# EAGLE design untitled (EAGLE 9.6.2)
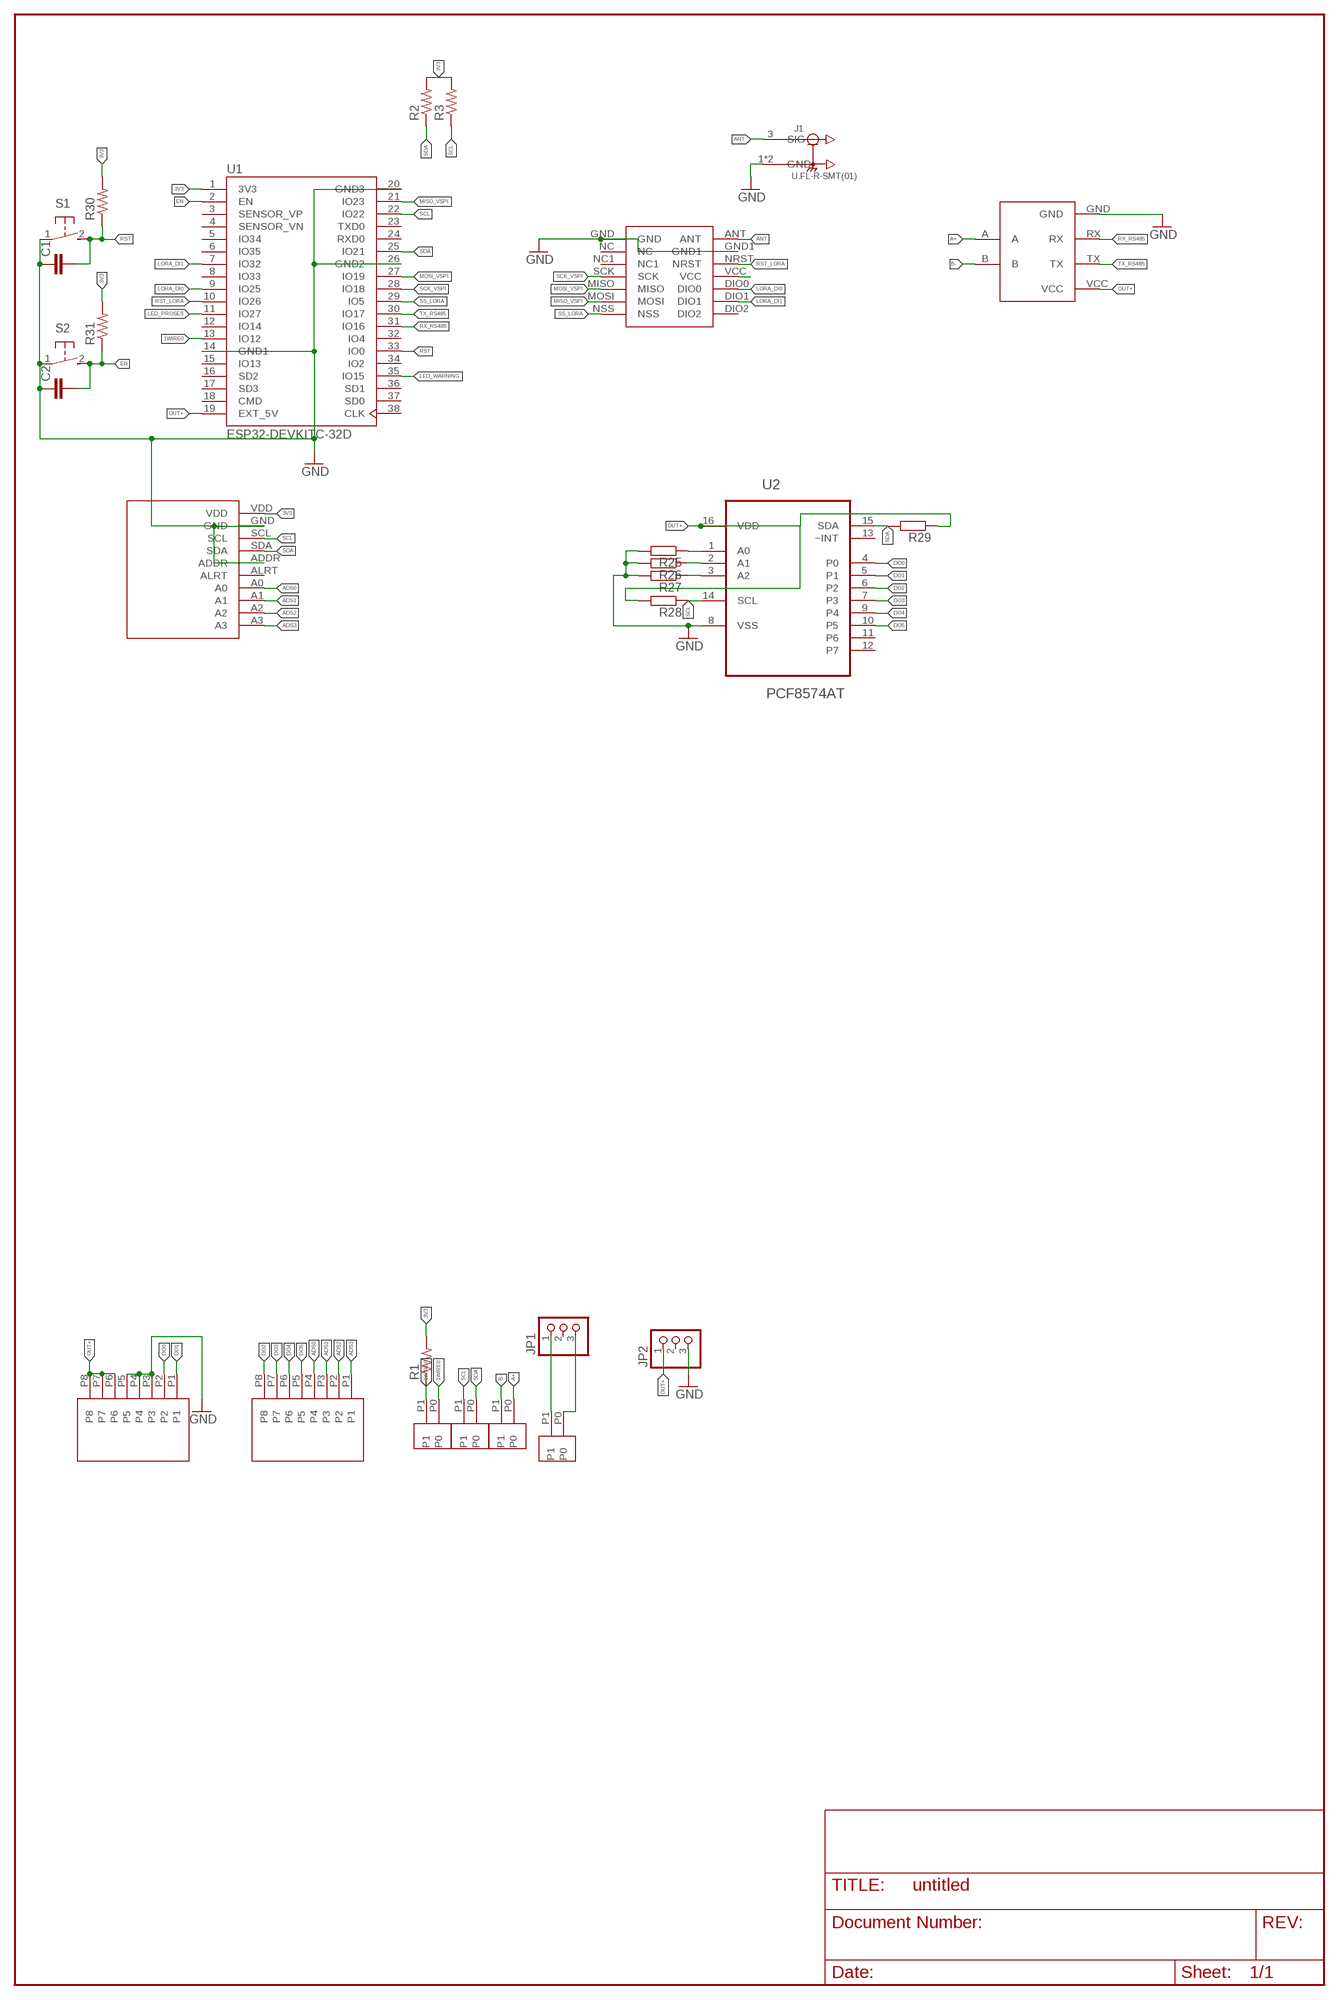
[diagram p0: schematic, sheet 1]

## Parts
ADS1  ADS1115  [ADS1115]
C1  C-EUC0805K  [C0805K]
C2  C-EUC0805K  [C0805K]
CONN2P-3.5PI1  CONN2P-3.5PI  [CONN2P-3.5PI]
CONN2P-3.5PI2  CONN2P-3.5PI  [CONN2P-3.5PI]
CONN2P-3.5PI3  CONN2P-3.5PI  [CONN2P-3.5PI]
CONN2P-3.5PI5  CONN2P-3.5PI  [CONN2P-3.5PI]
CONN3.1  CONN3.5  [CONN3.5]
CONN3.2  CONN3.5  [CONN3.5]
J1  U.FL-R-SMT(01)  [HRS_U.FL-R-SMT(01)]
JP1  PINHD-1X3  [1X03]
JP2  PINHD-1X3  [1X03]
LORA-NICERF-V1  LORA-NICERF-V2  [LORA-NICERF-V2]
R1  R-US_M0805  [M0805]
R2  R-US_M0805  [M0805]
R3  R-US_M0805  [M0805]
R25  R-EU_R0805  [R0805]
R26  R-EU_R0805  [R0805]
R27  R-EU_R0805  [R0805]
R28  R-EU_R0805  [R0805]
R29  R-EU_R0805  [R0805]
R30  R-US_M0805  [M0805]
R31  R-US_M0805  [M0805]
S1  31-XX  [B3F-31XX]
S2  31-XX  [B3F-31XX]
TTL-RS1  TTL-RS485  [TTL-RS485]
U1  ESP32-DEVKITC-32D  [MODULE_ESP32-DEVKITC-32D]
U2  PCF8574AT  [SOIC127P1032X265-16N]

## Nets
1WIRE0: CONN2P-3.5PI3.P0 CONN2P-3.5PI3.P1 R1.1 U1.13(IO12)
3V3: ADS1.VDD R1.2 R2.2 R3.2 R30.2 R31.2 U1.1(3V3)
A+: CONN2P-3.5PI5.P0 TTL-RS1.A
ADS0: ADS1.A0 CONN3.2.P4
ADS1: ADS1.A1 CONN3.2.P3
ADS2: ADS1.A2 CONN3.2.P2
ADS3: ADS1.A3 CONN3.2.P1
ANT: J1.3(SIG) LORA-NICERF-V1.ANT
B-: CONN2P-3.5PI5.P1 TTL-RS1.B
DO0: CONN3.1.P2 U2.4(P0)
DO1: CONN3.1.P1 U2.5(P1)
DO2: CONN3.2.P8 U2.6(P2)
DO3: CONN3.2.P7 U2.7(P3)
DO4: CONN3.2.P6 U2.9(P4)
DO5: CONN3.2.P5 U2.10(P5)
EN: C2.2 R31.1 S2.2(S) U1.2(EN)
GND: ADS1.ADDR ADS1.GND C1.1 C2.1 CONN3.1.P3 CONN3.1.P4 CONN3.1.P5 J1.1(GND) J1.2(GND) JP2.3 LORA-NICERF-V1.GND LORA-NICERF-V1.GND1 R25.2 R26.2 R27.2 S1.1(P) S2.1(P) TTL-RS1.GND U1.14(GND1) U1.20(GND3) U1.26(GND2) U2.8(VSS)
LED_PROSES: U1.11(IO27)
LED_WARNING: U1.35(IO15)
LORA_DI0: LORA-NICERF-V1.DIO0 U1.9(IO25)
LORA_DI1: LORA-NICERF-V1.DIO1 U1.7(IO32)
MISO_VSPI: LORA-NICERF-V1.MOSI U1.21(IO23)
MOSI_VSPI: LORA-NICERF-V1.MISO U1.27(IO19)
N$1: R25.1 U2.1(A0)
N$2: R26.1 U2.2(A1)
N$3: R27.1 U2.3(A2)
N$4: CONN2P-3.5PI1.P1 JP1.1
N$5: CONN2P-3.5PI1.P0 JP1.3
N$26: LORA-NICERF-V1.VCC
OUT+: CONN3.1.P6 CONN3.1.P7 CONN3.1.P8 JP2.1 R28.2 R29.1 TTL-RS1.VCC U1.19(EXT_5V) U2.16(VDD)
RST: C1.2 R30.1 S1.2(S) U1.33(IO0)
RST_LORA: LORA-NICERF-V1.NRST U1.10(IO26)
RX_RS485: TTL-RS1.RX U1.31(IO16)
SCK_VSPI: LORA-NICERF-V1.SCK U1.28(IO18)
SCL: ADS1.SCL CONN2P-3.5PI2.P1 R3.1 R28.1 U1.22(IO22) U2.14(SCL)
SDA: ADS1.SDA CONN2P-3.5PI2.P0 R2.1 R29.2 U1.25(IO21) U2.15(SDA)
SS_LORA: LORA-NICERF-V1.NSS U1.29(IO5)
TX_RS485: TTL-RS1.TX U1.30(IO17)
Unconnected: ADS1.ALRT JP1.2 JP2.2 LORA-NICERF-V1.DIO2 LORA-NICERF-V1.NC LORA-NICERF-V1.NC1 U1.3(SENSOR_VP) U1.4(SENSOR_VN) U1.5(IO34) U1.6(IO35) U1.8(IO33) U1.12(IO14) U1.15(IO13) U1.16(SD2) U1.17(SD3) U1.18(CMD) U1.23(TXD0) U1.24(RXD0) U1.32(IO4) U1.34(IO2) U1.36(SD1) U1.37(SD0) U1.38(CLK) U2.11(P6) U2.12(P7) U2.13(~INT)

## Library data of the parts
ADS1 = ds1115:ADS1115
C1 C2 = rcl:C-EU: CAPACITOR, European symbol; SPICEPREFIX: C
CONN2P-3.5PI1-CONN2P-3.5PI3 CONN2P-3.5PI5 = CONN2P-3.5PI:CONN2P-3.5PI
CONN3.1 CONN3.2 = CONN3.5:CONN3.5
J1 = U.FL-R-SMT_01_:U.FL-R-SMT(01): U.FL Series 6 Ghz 50 Ohm Ultra-small SMT Coaxial Cable Receptacle Check availability <https://pricing.snapeda.com/parts/U.FL-R-SMT%2801%29/Hirose/view-part?ref=eda>; AVAILABILITY: In Stock; DESCRIPTION: U.FL (UMCC) Connector Receptacle, Male Pin 50Ohm Surface Mount Solder. RF Connectors / Coaxial Connectors; MF: Hirose; MP: U.FL-R-SMT(01); PACKAGE: None; PRICE: None; PURCHASE-URL: https://pricing.snapeda.com/search/part/U.FL-R-SMT(01)/?ref=eda
JP1 JP2 = pinhead:PINHD-1X3: PIN HEADER
LORA-NICERF-V1 = LORA-NICERF-V2:LORA-NICERF-V2
R1-R3 R30 R31 = adafruit:R-US_: RESISTOR, American symbol
R25-R29 = rcl:R-EU_: RESISTOR, European symbol; SPICEPREFIX: R
S1 S2 = switch-omron:31-XX: OMRON SWITCH; MPN: B3F-3100; OC_FARNELL: 959704; OC_NEWARK: 36M3582
TTL-RS1 = TTL-RS485:TTL-RS485
U1 = ESP32-DEVKITC-32D:ESP32-DEVKITC-32D: Eval Board For Esp-Wroom-32 Check availability <https://pricing.snapeda.com/parts/ESP32-DEVKITC-32D/Espressif%20Systems/view-part?ref=eda>; AVAILABILITY: In Stock; DESCRIPTION: WiFi Development Tools (802.11) ESP32 General Development Kit, ESP32-WROOM-32D on the board; MF: Espressif Systems; MP: ESP32-DEVKITC-32D; PACKAGE: None; PRICE: None; PURCHASE-URL: https://pricing.snapeda.com/search/part/ESP32-DEVKITC-32D/?ref=eda
U2 = PCF8574AT:PCF8574AT: Remote 8-bit I/O expander for I2C-bus Check availability <https://pricing.snapeda.com/parts/PCF8574AT/NXP%20USA/view-part?ref=eda>; AVAILABILITY: In Stock; DESCRIPTION: I²C Bus IC Operating temperature: -40...+85 °C Power supply: 2.5...6 V Package: SO-16W; MF: NXP USA; MP: PCF8574AT; PACKAGE: SOIC-16 NXP USA; PRICE: None; PURCHASE-URL: https://pricing.snapeda.com/search/part/PCF8574AT/?ref=eda

## Board
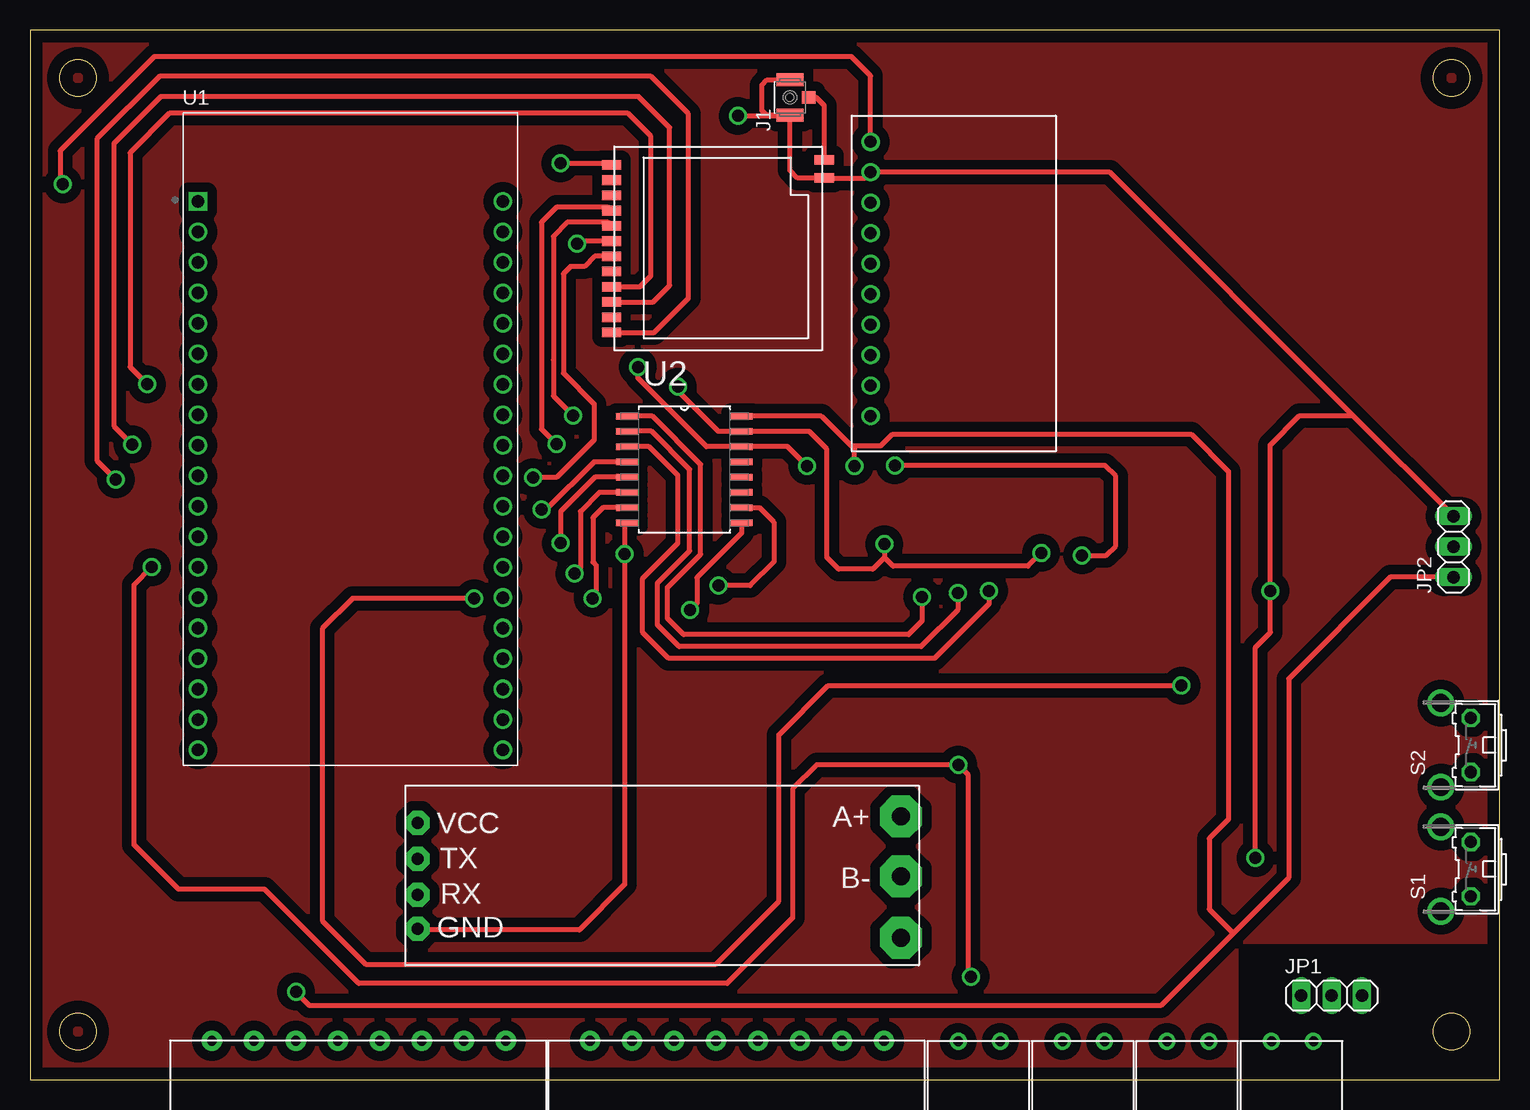
[diagram p1: board, top side]
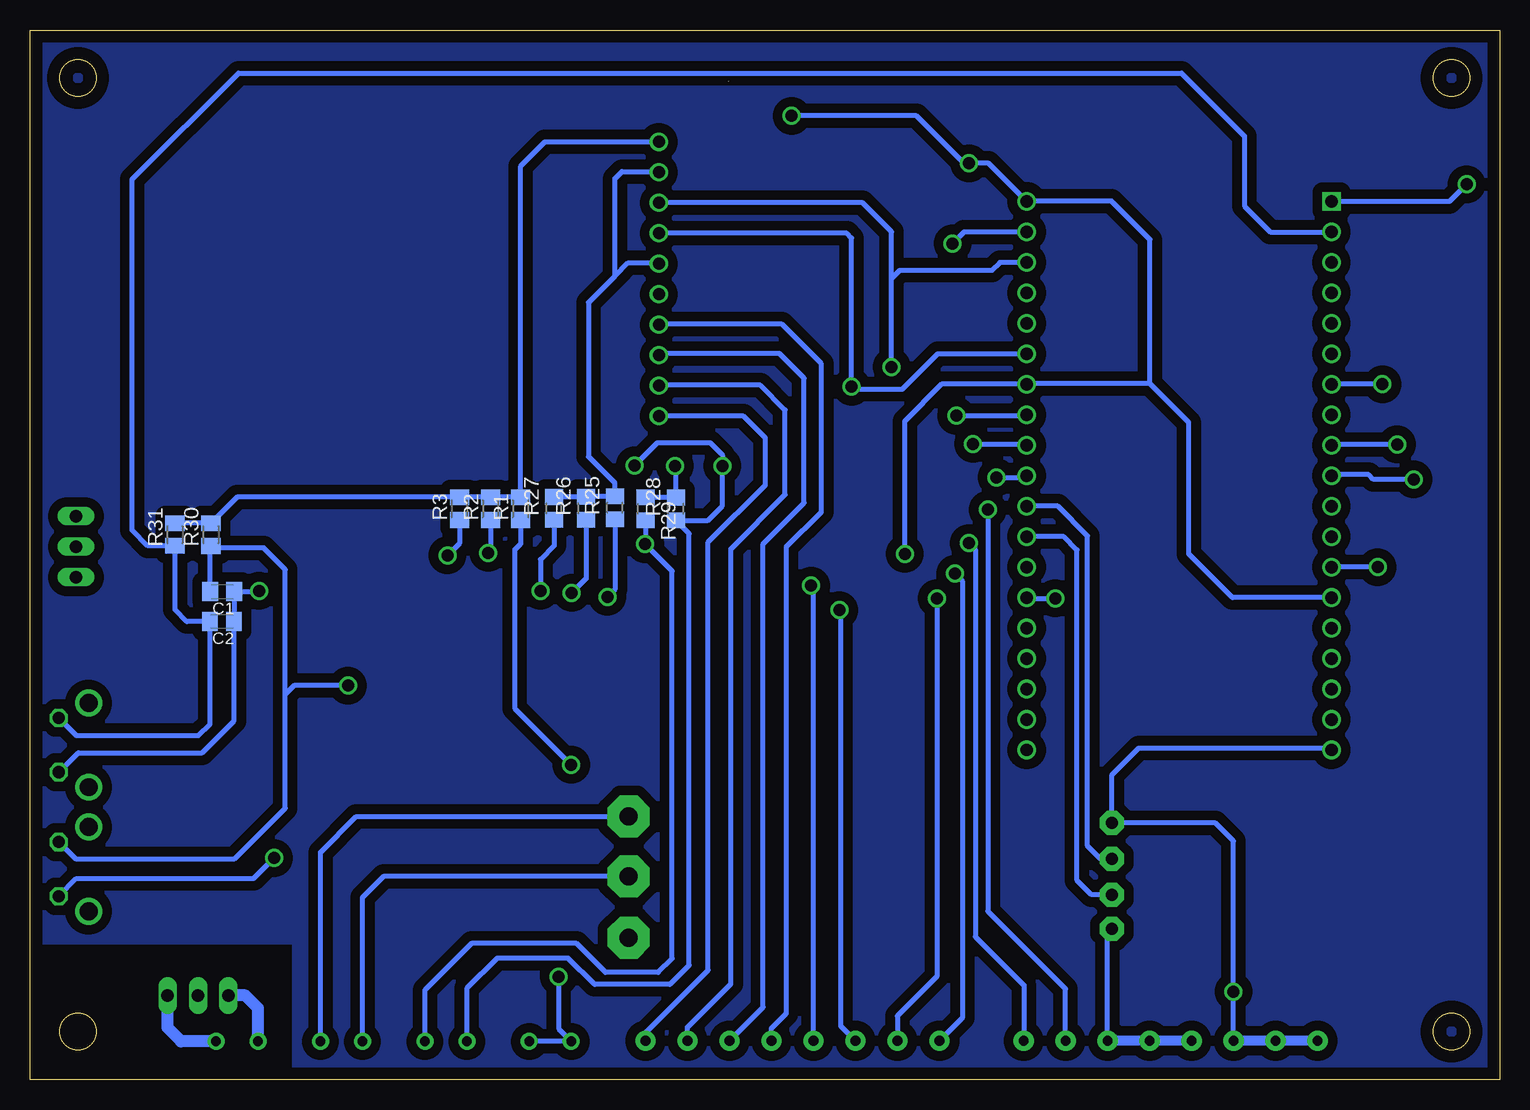
[diagram p2: board, bottom side, seen from below]

Size 122.5 x 87.5 mm. Coordinates in mm from the lower left corner, seen from the top.
Outline: 0,0 122.5,0 122.5,87.5 0,87.5 0,0
Outline: circle at 118.5,83.5 radius 1.5
Outline: circle at 118.5,4 radius 1.5
Outline: circle at 4,4 radius 1.5
Outline: circle at 4,83.5 radius 1.5
Copper layers (1*16): Top 0.035mm / dielectric 1.5mm / Bottom 0.035mm
Design rules "default": minimum track width 6mil, minimum drill 0.35mm, track to track 6mil, track to pad 6mil, pad to pad 6mil, via to via 6mil, smd to smd 6mil, copper to edge 40mil, drill to drill 6mil, minimum pad ring 10mil, minimum via ring 8mil, stop-mask expansion 4mil, vias tented up to drill 0mil, thermal gap 10mil

### Footprints (pad centres in the part's own frame; a part is rotated, then mirrored left to right if it is on the bottom)
ADS1115 = drill 1: A0 -6.35,-1.27; A1 -6.35,-3.81; A2 -6.35,-6.35; A3 -6.35,-8.89; ADDR -6.35,3.81; ALRT -6.35,1.27; GND -6.35,11.43; SCL -6.35,8.89; SDA -6.35,6.35; VDD -6.35,13.97
C0805K = smd 1.3 x 1.6: 1 -1,0; 2 1,0
CONN2P-3.5PI = drill 0.8 pad 1.422: P0 2.421,0.016; P1 5.921,0.016
CONN3.5 = drill 0.8 pad 1.676: P1 -28,0; P2 -24.5,0; P3 -21,0; P4 -17.5,0; P5 -14,0; P6 -10.5,0; P7 -7,0; P8 -3.5,0
HRS_U.FL-R-SMT(01) = smd 1.1 x 2.25: 1 -1.475,0; 2 1.475,0 | smd 1.05 x 1.1: 3 0,-1.55
1X03 = drill 1.016 long: 1 -2.54,0; 2 0,0; 3 2.54,0
LORA-NICERF-V2 = smd 1.6 x 0.8: ANT 9.17,6.81; DIO0 -8.57,-5.03; DIO1 -8.57,-3.76; DIO2 -8.57,-2.49; GND -8.57,6.4; GND1 9.17,5.31; MISO -8.57,1.32; MOSI -8.57,0.05; NC -8.57,5.13; NC1 -8.57,3.86; NRST -8.57,-7.57; NSS -8.57,-1.22; SCK -8.57,2.59; VCC -8.57,-6.3
M0805 = smd 1.3 x 1.6: 1 -0.95,0; 2 0.95,0
R0805 = smd 1.3 x 1.5: 1 -0.95,0; 2 0.95,0
B3F-31XX = drill 1.016 octagon: 1 -2.261,-1.245; 2 2.261,-1.245 | drill 1.499 pad 2.159: 3 -3.505,1.245; 4 3.505,1.245
TTL-RS485 = drill 1.5 pad 3.5 octagon: A -19.7,-6; B -19.7,-1; P$7 -19.7,4.1 | drill 1 pad 2 octagon: GND 20.6,3.37; RX 20.581,0.505; TX 20.583,-2.493; VCC 20.6,-5.47
MODULE_ESP32-DEVKITC-32D = drill 1.04 square: 1 -12.7,19.76 | drill 1.04: 2 -12.7,17.22; 3 -12.7,14.68; 4 -12.7,12.14; 5 -12.7,9.6; 6 -12.7,7.06; 7 -12.7,4.52; 8 -12.7,1.98; 9 -12.7,-0.56; 10 -12.7,-3.1; 11 -12.7,-5.64; 12 -12.7,-8.18; 13 -12.7,-10.72; 14 -12.7,-13.26; 15 -12.7,-15.8; 16 -12.7,-18.34; 17 -12.7,-20.88; 18 -12.7,-23.42; 19 -12.7,-25.96; 20 12.7,19.76; 21 12.7,17.22; 22 12.7,14.68; 23 12.7,12.14; 24 12.7,9.6; 25 12.7,7.06; 26 12.7,4.52; 27 12.7,1.98; 28 12.7,-0.56; 29 12.7,-3.1; 30 12.7,-5.64; 31 12.7,-8.18; 32 12.7,-10.72; 33 12.7,-13.26; 34 12.7,-15.8; 35 12.7,-18.34; 36 12.7,-20.88; 37 12.7,-23.42; 38 12.7,-25.96
SOIC127P1032X265-16N = smd 1.803 x 0.533: 1 -4.775,4.445; 2 -4.775,3.175; 3 -4.775,1.905; 4 -4.775,0.635; 5 -4.775,-0.635; 6 -4.775,-1.905; 7 -4.775,-3.175; 8 -4.775,-4.445; 9 4.775,-4.445; 10 4.775,-3.175; 11 4.775,-1.905; 12 4.775,-0.635; 13 4.775,0.635; 14 4.775,1.905; 15 4.775,3.175; 16 4.775,4.445

### Placement (x,y rotation side)
ADS1  76.43,64.2 0 top
C1  106.48,40.68 180 bottom
C2  106.5,38.19 180 bottom
CONN2P-3.5PI1  109.41,3.2 180 top
CONN2P-3.5PI2  92,3.2 180 top
CONN2P-3.5PI3  83.3,3.2 180 top
CONN2P-3.5PI5  100.7,3.2 180 top
CONN3.1  11.67,3.23 180 top
CONN3.2  43.19,3.23 180 top
J1  63.36,81.87 90 top
JP1  108.5,7 0 top
JP2  118.67,44.42 90 top
LORA-NICERF-V1  57.04,69.85 0 top
R1  81.6,47.6 90 bottom
R2  84.1,47.6 90 bottom
R3  86.7,47.6 90 bottom
R25  73.75,47.67 90 bottom
R26  76.15,47.63 90 bottom
R27  78.81,47.61 90 bottom
R28  68.66,47.57 90 bottom
R29  71.21,47.58 270 bottom
R30  107.41,45.43 90 bottom
R31  110.41,45.43 90 bottom
S1  118.86,17.54 90 top
S2  118.86,27.88 90 top
TTL-RS1  52.9,15.92 180 top
U1  26.71,53.44 0 top
U2  54.55,50.85 0 top

### Tracks (layer width: path | path; a pad name or v marks a point on that pad's centre or on a via)
1WIRE0  (via drill 1)
  Top 0.406: v78.44,8.57 78.18,8.82 78.18,25.44 v77.39,26.23 65.6,26.23 63.58,24.21 63.58,13.47 58.11,8 27.42,8 19.55,15.87 12.38,15.87 8.68,19.56 8.68,41.25 v10.15,42.72
  Bottom 0.406: CONN2P-3.5PI3.P0 CONN2P-3.5PI3.P1 78.44,4.24 v78.44,8.57 | R1.1 81.6,44.65 82.1,44.15 82.1,30.94 v77.39,26.23 | v10.15,42.72 v10.16,42.72 U1.13
3V3  (via drill 1)
  Top 0.406: ADS1.VDD 70.08,83.67 68.46,85.29 10.37,85.29 2.51,77.43 2.51,74.86 v2.73,74.63
  Bottom 0.406: R31.2 R30.2 106.3,47.5 105.35,48.45 105.25,48.55 R3.2 | R1.2 81.6,76.14 79.57,78.17 ADS1.VDD | 81.62,48.57 R1.2 | v2.73,74.63 4.17,73.2 U1.1 | 86.6,48.65 R3.2 | R1.2 R2.2 R3.2
A+
  Bottom 0.406: CONN2P-3.5PI5.P0 98.28,18.94 95.3,21.92 TTL-RS1.A
ADS0
  Bottom 0.406: CONN3.2.P4 60.69,4.26 59.46,5.49 59.46,44.38 56.53,47.3 56.53,59.68 59.82,62.97 70.04,62.97 ADS1.A0
ADS1
  Bottom 0.406: CONN3.2.P3 61.39,6.03 61.39,44.66 57.97,48.08 57.97,58.47 60.02,60.52 69.95,60.52 ADS1.A1
ADS2
  Bottom 0.406: CONN3.2.P2 67.69,4.36 64.08,7.98 64.08,44.24 59.55,48.76 59.55,55.83 61.61,57.88 70.05,57.88 ADS1.A2
ADS3
  Bottom 0.406: CONN3.2.P1 71.19,3.88 65.96,9.11 65.96,44.8 61.2,49.55 61.2,53.49 63.02,55.31 ADS1.A3
ANT
  Top 0.406: LORA-NICERF-V1.ANT 66.21,81.2 65.54,81.87 J1.3
B-
  Bottom 0.406: CONN2P-3.5PI5.P1 94.78,15.17 93.05,16.9 93.03,16.92 TTL-RS1.B
DO0  (via drill 1)
  Top 0.406: U2.4 47.02,51.48 43.04,47.51 v42.66,47.51
  Bottom 0.406: v42.66,47.51 v42.66,47.5 42.66,14.04 36.17,7.55 CONN3.1.P2 36.12,3.28
DO1  (via drill 1)
  Top 0.406: U2.5 47.1,50.22 44.25,47.36 v44.25,44.73
  Bottom 0.406: v44.25,44.73 43.69,44.17 43.69,11.91 39.64,7.86 39.64,3.26 CONN3.1.P1
DO2  (via drill 1)
  Top 0.406: U2.6 47.46,48.95 45.88,47.37 45.88,42.66 v45.38,42.17
  Bottom 0.406: v45.38,42.17 44.78,41.56 44.78,5.14 CONN3.2.P8
DO3  (via drill 1)
  Top 0.406: U2.7 47.75,47.67 46.92,46.84 46.92,43.13 47.19,42.86 47.19,40.39 v46.91,40.11
  Bottom 0.406: v46.91,40.11 46.91,8.59 50.19,5.31 CONN3.2.P7
DO4  (via drill 1)
  Top 0.406: U2.9 59.33,45.58 55.59,41.84 55.59,39.68 v55.04,39.13
  Bottom 0.406: v55.04,39.13 54.92,39.02 54.92,4.46 CONN3.2.P6
DO5  (via drill 1)
  Top 0.406: U2.10 60.8,47.67 62,46.48 62,43.15 60.02,41.17 v57.38,41.17
  Bottom 0.406: CONN3.2.P5 57.19,41.17 v57.38,41.17
EN
  Bottom 0.406: S2.2 118.64,28.67 108.46,28.67 107.5,29.64 C2.2 109.42,38.19 110.41,39.18 R31.1 112.67,44.48 113.98,45.8 113.98,75.04 105.12,83.9 26.52,83.9 21.26,78.65 21.26,72.83 19.09,70.66 U1.2
GND  (via drill 1)
  Top 0.406: J1.2 61.46,83.35 61.02,82.91 61.02,80.77 61.4,80.39 J1.1 63.34,80.38 63.34,80.02 | 63.34,80.02 63.34,75.8 63.98,75.16 LORA-NICERF-V1.GND1 69.61,75.16 ADS1.GND 90,75.63 110.28,55.35 | U2.8 49.58,46.2 v49.58,43.83 49.58,16.26 45.79,12.48 32.37,12.48 TTL-RS1.GND | JP2.3 110.28,55.35 | v44.22,76.39 48.33,76.39 LORA-NICERF-V1.GND | v59.02,80.35 63.01,80.35 63.34,80.02 | 110.28,55.35 105.83,55.35 103.39,52.91 103.39,40.74 v103.4,40.73 103.4,37.28 102.16,36.03 v102.16,18.47
  Bottom 0.406: CONN3.1.P3 32.67,12.18 TTL-RS1.GND | R27.2 78.8,48.58 R26.2 76.1,48.62 R25.2 73.75,49.72 75.95,51.92 75.95,64.77 73.75,66.97 | 73.75,66.97 72.63,68.08 70.15,68.08 ADS1.ADDR | v49.58,43.83 49.58,54.89 46.46,58 39.45,58 | 39.45,58 U1.26 | S2.1 118.48,27.25 108.15,27.25 105.5,29.9 C2.1 105.5,40.06 105.47,40.09 105.47,40.66 C1.1 103.46,40.68 v103.4,40.73 | U1.20 39.46,73.25 | 39.46,73.25 42.6,76.39 v44.22,76.39 44.65,76.39 48.61,80.35 v59.02,80.35 | U1.14 22.25,40.18 25.9,43.83 25.9,54.77 29.13,58 | 29.13,58 39.45,58 | v103.4,40.73 | S1.1 118.63,16.76 103.86,16.76 v102.16,18.47 | 73.75,66.97 73.75,75.12 73.16,75.71 70.16,75.71 ADS1.GND | 29.13,58 29.13,70.03 32.35,73.25 39.46,73.25
  Bottom 0.813: CONN3.1.P5 CONN3.1.P4 CONN3.1.P3
LORA_DI0  (via drill 1)
  Top 0.406: LORA-NICERF-V1.DIO0 51.94,64.82 53.32,66.2 53.32,79.36 50.73,81.94 10.91,81.94 7,78.03 7,54.5 v8.54,52.95
  Bottom 0.406: v8.54,52.95 13.94,52.95 U1.9
LORA_DI1  (via drill 1)
  Top 0.406: LORA-NICERF-V1.DIO1 50.84,66.09 51.75,67 51.75,78.63 49.84,80.54 11.62,80.54 8.34,77.26 8.34,59.4 v9.77,57.98
  Bottom 0.406: v9.77,57.98 13.99,57.98 U1.7
MISO_VSPI  (via drill 1)
  Top 0.406: LORA-NICERF-V1.MOSI 45.8,69.9 v45.59,69.69
  Bottom 0.406: U1.21 44.63,70.66 v45.59,69.69
MOSI_VSPI  (via drill 1)
  Top 0.406: LORA-NICERF-V1.MISO 48.18,71.46 44.79,71.46 43.63,70.31 43.63,59.99 43.63,56.99 v45.27,55.35
  Bottom 0.406: v45.27,55.35 39.48,55.35 U1.27
N$1  (via drill 1)
  Top 0.406: v74.37,40.24 74.37,38.24 73.23,37.09 54.49,37.09 53.14,38.44 53.14,41.03 55.9,43.78 55.9,51.28 51.89,55.3 U2.1
  Bottom 0.406: R25.1 73.75,40.87 v74.37,40.24
N$2  (via drill 1)
  Top 0.406: v77.35,40.57 77.35,39.16 74.28,36.09 54.11,36.09 52.3,37.9 52.3,41.39 54.99,44.08 54.99,50.87 51.81,54.05 49.8,54.05 U2.2
  Bottom 0.406: R26.1 76.14,41.77 v77.35,40.57
N$3  (via drill 1)
  Top 0.406: v79.95,40.73 79.95,39.66 75.42,35.12 53.23,35.12 51.06,37.29 51.06,41.79 54,44.73 54,50.36 51.6,52.76 U2.3
  Bottom 0.406: R27.1 78.81,44.52 79.95,43.37 v79.95,40.73
N$4
  Bottom 1.016: CONN2P-3.5PI1.P1 103.49,5.95 104.55,7 JP1.1
N$5
  Bottom 1.016: CONN2P-3.5PI1.P0 109.9,3.18 111.04,4.33 JP1.3
N$6
  pour Bottom (isolate 0.813): 0,87.5 122.5,87.5 122.5,11.5 100.5,11.5 100.5,0 0,0
N$7
  pour Top (isolate 0.813): 0,87.5 122.5,87.5 122.5,11.5 100.5,11.5 100.5,0 0,0
OUT+  (via drill 1)
  Top 0.406: JP2.1 113.39,41.88 104.92,33.41 104.92,16.82 100.3,12.2 | 100.3,12.2 94.25,6.16 23.3,6.16 22.14,7.32 v22.17,7.32 | v68.75,51.16 68.75,52.53 68.44,52.84 | 68.44,52.84 65.98,55.3 U2.16 | 68.44,52.84 70.94,52.84 71.9,53.8 96.8,53.8 99.9,50.7 99.9,21.7 98.3,20.1 98.3,14.2 100.3,12.2
  Bottom 0.406: U1.19 14.16,27.63 30.07,27.63 32.3,25.4 TTL-RS1.VCC 23.69,21.39 22.17,19.88 v22.17,7.32 CONN3.1.P6 | R29.1 71.2,48.52 R28.2 68.66,51.07 v68.75,51.16
  Bottom 0.813: CONN3.1.P8 CONN3.1.P7 CONN3.1.P6
RST  (via drill 1)
  Top 0.406: v37.02,40.11 26.88,40.11 24.37,37.6 24.37,13.24 27.98,9.62 57.2,9.62 62.44,14.86 62.44,28.74 66.54,32.84 v95.99,32.84
  Bottom 0.406: C1.2 107.48,44.27 | 107.48,44.27 107.48,44.41 R30.1 | S1.2 118.7,18.4 105.44,18.4 101.22,22.62 101.22,32.1 | 101.22,32.1 101.22,42.52 103.01,44.31 107.44,44.31 107.48,44.27 | U1.33 39.34,40.11 v37.02,40.11 | v95.99,32.84 100.48,32.84 101.22,32.1
RST_LORA  (via drill 1)
  Top 0.406: LORA-NICERF-V1.NRST 52.03,62.28 54.88,65.13 54.88,80.52 51.76,83.64 10.8,83.64 5.58,78.42 5.58,51.61 v7.16,50.03
  Bottom 0.406: v7.16,50.03 10.52,50.03 10.91,50.42 13.93,50.42 U1.10
RX_RS485
  Bottom 0.406: TTL-RS1.RX 34.02,15.41 35.23,16.62 35.23,44.15 36.33,45.26 U1.31
SCK_VSPI  (via drill 1)
  Top 0.406: LORA-NICERF-V1.SCK 48.19,72.72 43.89,72.72 42.64,71.47 42.64,54.22 v43.88,52.98
  Bottom 0.406: v43.88,52.98 39.52,52.98 U1.28
SCL  (via drill 1)
  Top 0.406: v50.67,59.41 50.67,58.48 56.4,52.76 U2.14 59.35,52.78 63.14,52.78 v64.78,51.15 | v87.7,43.7 89.7,43.7 90.5,44.5 90.5,50.3 89.6,51.2 v72.1,51.2
  Bottom 0.406: U1.22 41.66,68.12 42.31,67.47 49.98,67.47 50.67,66.78 v50.67,59.41 50.67,70.67 53.1,73.1 70.07,73.1 ADS1.SCL | CONN2P-3.5PI2.P1 86.08,3.36 86.09,3.38 86.09,7.59 83.56,10.12 77.63,10.12 75.42,7.92 69.16,7.92 67.54,9.53 67.54,45.5 R28.1 65.98,46.62 64.78,47.83 v64.78,51.15 64.78,52.08 65.8,53.1 70.2,53.1 v72.1,51.2 | R3.1 86.7,44.7 v87.7,43.7
SDA  (via drill 1)
  Top 0.406: v54.02,57.76 54.02,57.4 57.39,54.02 U2.15 64.97,54.02 66.43,52.56 66.43,43.52 67.4,42.55 70.26,42.55 71.23,43.52 | v71.23,44.64 71.23,43.52 | v84.3,43.9 83.2,42.8 71.95,42.8 71.23,43.52
  Bottom 0.406: U1.25 46.83,60.51 49.78,57.55 53.81,57.55 v54.02,57.76 54.02,70.16 54.41,70.55 ADS1.SDA | R29.2 71.21,44.65 v71.23,44.64 68.98,42.39 68.98,10.08 70.14,8.92 74.53,8.92 76.96,11.35 85.69,11.35 89.58,7.46 CONN2P-3.5PI2.P0 | R2.1 84.1,44.1 v84.3,43.9
SS_LORA  (via drill 1)
  Top 0.406: LORA-NICERF-V1.NSS 47.08,68.63 46.22,67.77 45.06,67.77 44.46,67.18 44.46,58.88 47.02,56.32 47.02,53.32 43.89,50.19 v41.92,50.19
  Bottom 0.406: v41.92,50.19 39.56,50.19 U1.29
TX_RS485
  Bottom 0.406: TTL-RS1.TX 33.29,18.41 34.34,19.46 34.34,45.31 36.82,47.8 U1.30